# EAGLE design psx-2_Multi-Out (EAGLE 9.6.1)
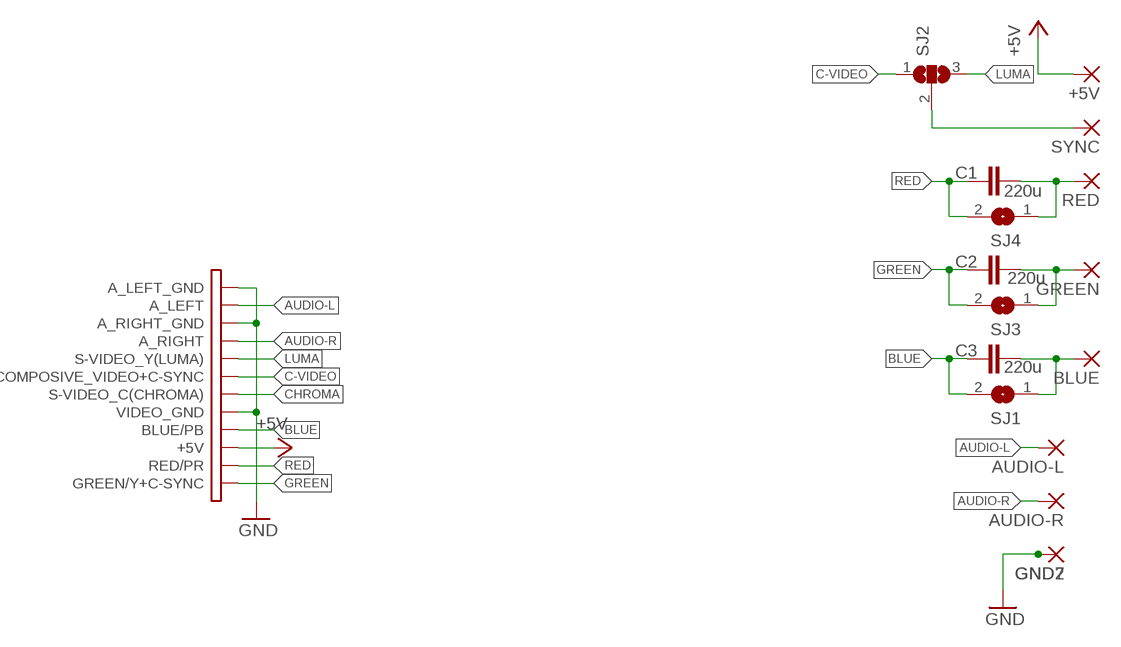
[diagram p0: schematic, sheet 1]

## Parts
+5V  WIREPADSMD1,27-254  [SMD1,27-2,54]
AUDIO-L  WIREPADSMD1,27-254  [SMD1,27-2,54]
AUDIO-R  WIREPADSMD1,27-254  [SMD1,27-2,54]
BLUE  WIREPADSMD1,27-254  [SMD1,27-2,54]
C1  220u  C-EUC1206  [C1206]
C2  220u  C-EUC1206  [C1206]
C3  220u  C-EUC1206  [C1206]
GND2  WIREPADSMD1,27-254  [SMD1,27-2,54]
GND7  WIREPADSMD1,27-254  [SMD1,27-2,54]
GREEN  WIREPADSMD1,27-254  [SMD1,27-2,54]
J1  PS/2_MULTI-AV  [PS/2_MULTI-AV]
RED  WIREPADSMD1,27-254  [SMD1,27-2,54]
SJ1  SJ  [SJ]
SJ2  SJ2W  [SJ_2]
SJ3  SJ  [SJ]
SJ4  SJ  [SJ]
SYNC  WIREPADSMD1,27-254  [SMD1,27-2,54]

## Nets
+5V: +5V.1(P) J1.+5V
AUDIO-L: AUDIO-L.1(P) J1.A_LEFT
AUDIO-R: AUDIO-R.1(P) J1.A_RIGHT
BLUE: C3.1 J1.BLUE/PB SJ1.2
BLUE'': BLUE.1(P) C3.2 SJ1.1
C-VIDEO: J1.COMPOSITE_VIDEO+C-SYNC(COMPOSIVE_VIDEO+C-SYNC) SJ2.1
CHROMA: J1.S-VIDEO_C(CHROMA)
GND: GND2.1(P) GND7.1(P) J1.A_LEFT_GND J1.A_RIGHT_GND J1.VIDEO_GND
GREEN: C2.1 J1.GREEN/Y+C-SYNC SJ3.2
GREEN'': C2.2 GREEN.1(P) SJ3.1
LUMA: J1.S-VIDEO_Y(LUMA) SJ2.3
RED: C1.1 J1.RED/PR SJ4.2
RED'': C1.2 RED.1(P) SJ4.1
SYNC: SJ2.2 SYNC.1(P)

## Library data of the parts
+5V AUDIO-L AUDIO-R BLUE GND2 GND7 GREEN RED SYNC = wirepad:WIREPAD: Wire PAD connect wire on PCB
C1 = rcl:C-EU: CAPACITOR, European symbol; SPICEPREFIX: C
C2 C3 = resistor:C-EU: CAPACITOR, European symbol
J1 = PS-2_Multi-AV:PS/2_MULTI-AV
SJ1 SJ3 SJ4 = jumper:SJ: SMD solder JUMPER
SJ2 = jumper:SJ2W: SMD solder JUMPER

## Board
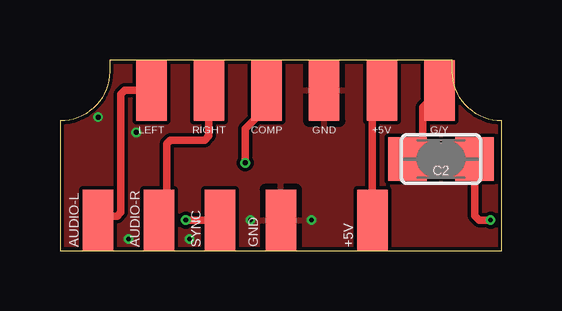
[diagram p1: board, top side]
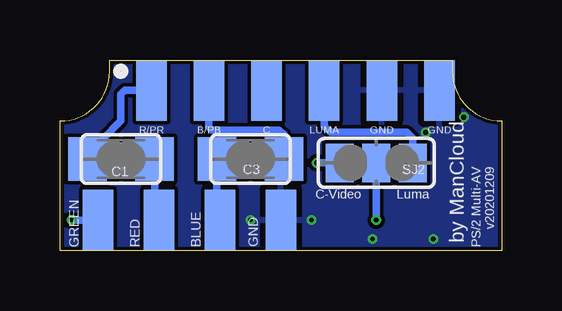
[diagram p2: board, bottom side, seen from below]

Size 18.41 x 7.94 mm. Coordinates in mm from the lower left corner, seen from the top.
Outline: 0,0 18.41,0 18.41,5.4 arc-90 16.35,7.46 16.35,7.94 2.06,7.94 2.06,7.46 arc-90 0,5.4 0,0
Copper layers (1*16): Top 0.035mm / dielectric 1.5mm / Bottom 0.035mm
Design rules "default *": minimum track width 6mil, minimum drill 0.2mm, track to track 6mil, track to pad 6mil, pad to pad 6mil, via to via 6mil, smd to smd 6mil, copper to edge 6mil, drill to drill 6mil, minimum pad ring 10mil, minimum via ring 4mil, stop-mask expansion 4mil, vias tented up to drill 0mil, thermal gap 10mil

### Footprints (pad centres in the part's own frame; a part is rotated, then mirrored left to right if it is on the bottom)
SMD1,27-2,54 = smd 1.27 x 2.54: 1 0,0
C1206 = smd 1.6 x 1.8: 1 -1.4,0; 2 1.4,0
PS/2_MULTI-AV = smd 1.27 x 2.54: +5V 4.2,0; A_LEFT -5.4,0; A_RIGHT -3,0; COMPOSITE_VIDEO+C-SYNC -0.6,0; GREEN/Y+C-SYNC 6.6,0; VIDEO_GND 1.8,0 | smd 1.27 x 2.54 bottom: A_LEFT_GND -6.6,0; A_RIGHT_GND -4.2,0; BLUE/PB 3,0; RED/PR 5.4,0; S-VIDEO_C(CHROMA) 0.6,0; S-VIDEO_Y(LUMA) -1.8,0
SJ = smd 1.168 x 1.6: 1 -0.762,0; 2 0.762,0
SJ_2 = smd 1.168 x 1.6: 1 -1.524,0; 2 0,0; 3 1.524,0

### Placement (x,y rotation side)
+5V  13.02,1.27 0 top
AUDIO-L  1.59,1.27 0 top
AUDIO-R  4.13,1.27 0 top
BLUE  11.75,1.27 0 bottom
C1  15.88,3.81 0 bottom
C2  15.88,3.81 0 top
C3  10.48,3.81 180 bottom
GND2  9.21,1.27 0 bottom
GND7  9.21,1.27 180 top
GREEN  16.83,1.27 0 bottom
J1  9.21,6.67 0 top
RED  14.29,1.27 0 bottom
SJ1  10.48,3.81 0 bottom
SJ2  5.24,3.65 0 bottom
SJ3  15.88,3.81 180 top
SJ4  15.88,3.81 180 bottom
SYNC  6.67,1.27 0 top

### Tracks (layer width: path | path; a pad name or v marks a point on that pad's centre or on a via)
+5V
  Top 0.305: +5V.1 13.02,6.28 J1.+5V
AUDIO-L
  Top 0.305: AUDIO-L.1 1.75,1.43 2.38,1.43 2.54,1.59 2.54,6.51 2.7,6.67 J1.A_LEFT
AUDIO-R
  Top 0.305: J1.A_RIGHT 6.21,4.78 6.03,4.6 4.6,4.6 4.45,4.44 4.45,1.59 AUDIO-R.1
BLUE
  Bottom 0.305: J1.BLUE/PB 12.21,5.16 12.06,5.01 9.27,5.01 9.08,4.82 C3.1 SJ1.2
BLUE''
  Bottom 0.305: BLUE.1 11.88,1.4 C3.2 SJ1.1
C-VIDEO  (via drill 0.2)
  Top 0.305: J1.COMPOSITE_VIDEO+C-SYNC 8.61,5.97 7.71,5.08 v7.71,3.65
  Bottom 0.305: v7.71,3.65 SJ2.1
GND  (via drill 0.2)
  other vias: 7.94,1.27 10.48,1.27 5.4,0.48 2.86,0.48 3.17,4.92 1.59,5.56
  pour Top: 2.06,7.94 2.06,7.42 arc-90 0.06,5.42 0.16,0.16 18.33,0.16 18.4,5.41 arc-90 16.43,7.38 16.43,7.94
  pour Bottom: 16.35,7.89 16.35,7.45 arc90 18.39,5.41 18.33,0.16 0.16,0.16 0.05,5.42 arc90 2.06,7.43 2.06,7.89
GREEN
  Top 0.305: 15.56,3.81 15.24,3.81 SJ3.2 | SJ3.2 C2.1 | SJ3.2 15.11,5.97 J1.GREEN/Y+C-SYNC
GREEN''  (via drill 0.2)
  Top 0.305: v17.94,1.27 17.46,1.27 17.27,1.46 C2.2 SJ3.1
  Bottom 0.305: v17.94,1.27 GREEN.1
LUMA
  Bottom 0.305: J1.S-VIDEO_Y(LUMA) 7.41,5.19 7.14,4.92 3.97,4.92 3.71,4.67 SJ2.3
RED
  Bottom 0.305: J1.RED/PR 15.72,6.67 15.88,6.51 15.88,5.4 16.64,4.64 SJ4.2 C1.1
RED''
  Bottom 0.305: RED.1 14.47,1.46 C1.2 SJ4.1
SYNC  (via drill 0.2)
  Top 0.305: v5.24,1.27 SYNC.1
  Bottom 0.305: SJ2.2 v5.24,1.27

### Text on the board
tNames: GND
bNames: PS/2 Multi-AV / v20201209 | Luma | C-Video | by ManCloud | GND